# EAGLE design HandiFinder (EAGLE 9.4.1)
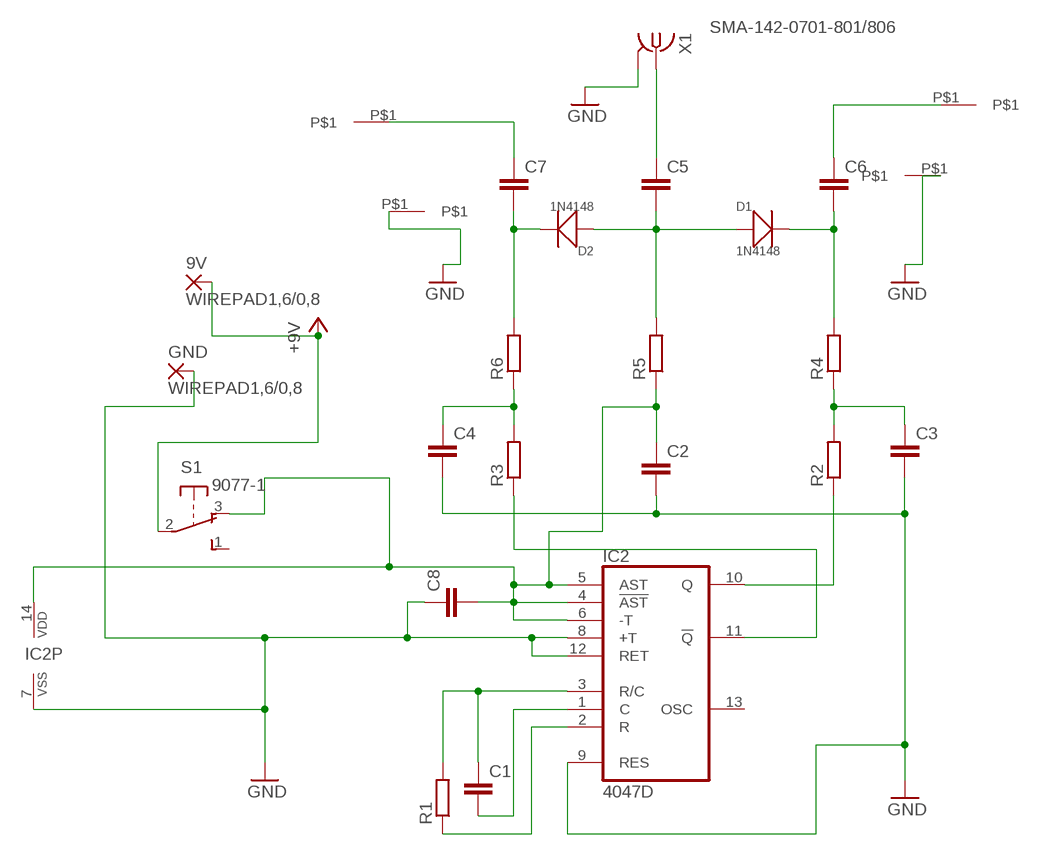
[diagram p0: schematic, sheet 1]

## Parts
9V  WIREPAD1,6/0,8  [1,6/0,8]
ANT1  ANT12  WIREPAD  [2.6MMHOLE]
ANT1GND2  WIREPAD  [2.6MMHOLE]
ANT2GND2  WIREPAD  [2.6MMHOLE]
ANT22  WIREPAD  [2.6MMHOLE]
C1  C-EUC0805K  [C0805K]
C2  C-EUC0805K  [C0805K]
C3  C-EUC0805K  [C0805K]
C4  C-EUC0805K  [C0805K]
C5  C-EUC0805K  [C0805K]
C6  C-EUC0805K  [C0805K]
C7  C-EUC0805K  [C0805K]
C8  C-EUC0805K  [C0805K]
D1  1N4148  SMD-DIODE-100V-200MA(SOD-123)  [SOD-123]
D2  1N4148  SMD-DIODE-100V-200MA(SOD-123)  [SOD-123]
GND  WIREPAD1,6/0,8  [1,6/0,8]
IC2  4047D  [SO14]
R1  R-EU_R0805  [R0805]
R2  R-EU_R0805  [R0805]
R3  R-EU_R0805  [R0805]
R4  R-EU_R0805  [R0805]
R5  R-EU_R0805  [R0805]
R6  R-EU_R0805  [R0805]
S1  9077-1  [9077-1]
X1  SMA-142-0701-801/806  [J502-ND-142-0701-801/806]

## Nets
+5V: 9V.1(P) S1.2(P) ; supply symbol labelled +9V
GND: ANT1GND2.P$1 ANT2GND2.P$1 C2.2 C3.2 C4.2 C8.1 GND.1(P) IC2.7(VSS) IC2.8(+T) IC2.9(RES) IC2.12(RET) X1.G@1 X1.G@2 X1.G@3 X1.G@4
N$1: C1.1 IC2.3(R/C) R1.2
N$2: C1.2 IC2.1(C)
N$3: IC2.2(R) R1.1
N$4: C7.2 D2.- R6.2
N$5: C3.1 R2.2 R4.1
N$6: C5.1 X1.1
N$7: C4.1 R3.2 R6.1
N$8: IC2.11(!Q) R3.1
N$9: IC2.10(Q) R2.1
N$10: C5.2 D1.+ D2.+ R5.2
N$11: C6.2 D1.- R4.2
N$14: ANT1.P$1 C7.1
N$15: ANT22.P$1 C6.1
N$16: C2.1 C8.2 IC2.4(!AST) IC2.5(AST) IC2.6(-T) IC2.14(VDD) R5.1 S1.3(O)
Unconnected: IC2.13(OSC) S1.1(S)

## Library data of the parts
9V GND = wirepad:WIREPAD: Wire PAD connect wire on PCB
ANT1 ANT1GND2 ANT2GND2 ANT22 = wirepad2.6:WIREPAD
C1-C8 = resistor:C-EU: CAPACITOR, European symbol
D1 D2 = Seeed-Diode-2016:SMD-DIODE-100V-200MA(SOD-123): 304010007; MPN: MMSD4148; VALUE: MMSD4148-sod123
IC2 = 40xx:4047: LP monostable/astable MULTIVIBRATOR
R1-R6 = resistor:R-EU_: RESISTOR, European symbol
S1 = switch-misc:9077-1: MARQUARDT SWITCH 9077.0100 Distributor: Buerklin <https://www.buerklin.com/default.asp?event=ShowArtikel%2812G2820%29&l=d&jump=ArtNr_12G2820>
X1 = con-coax:SMA-: SMA 50 Ohm End Launch Jack Receptacle - Round Contact Johnson Components Source: www.johnsoncomponents.com .. J502-ND.pdf; MF: JOHNSON COMPONENTS; MPN: 142-0701-801; OC_FARNELL: 1608592; OC_NEWARK: 90F2624

## Board
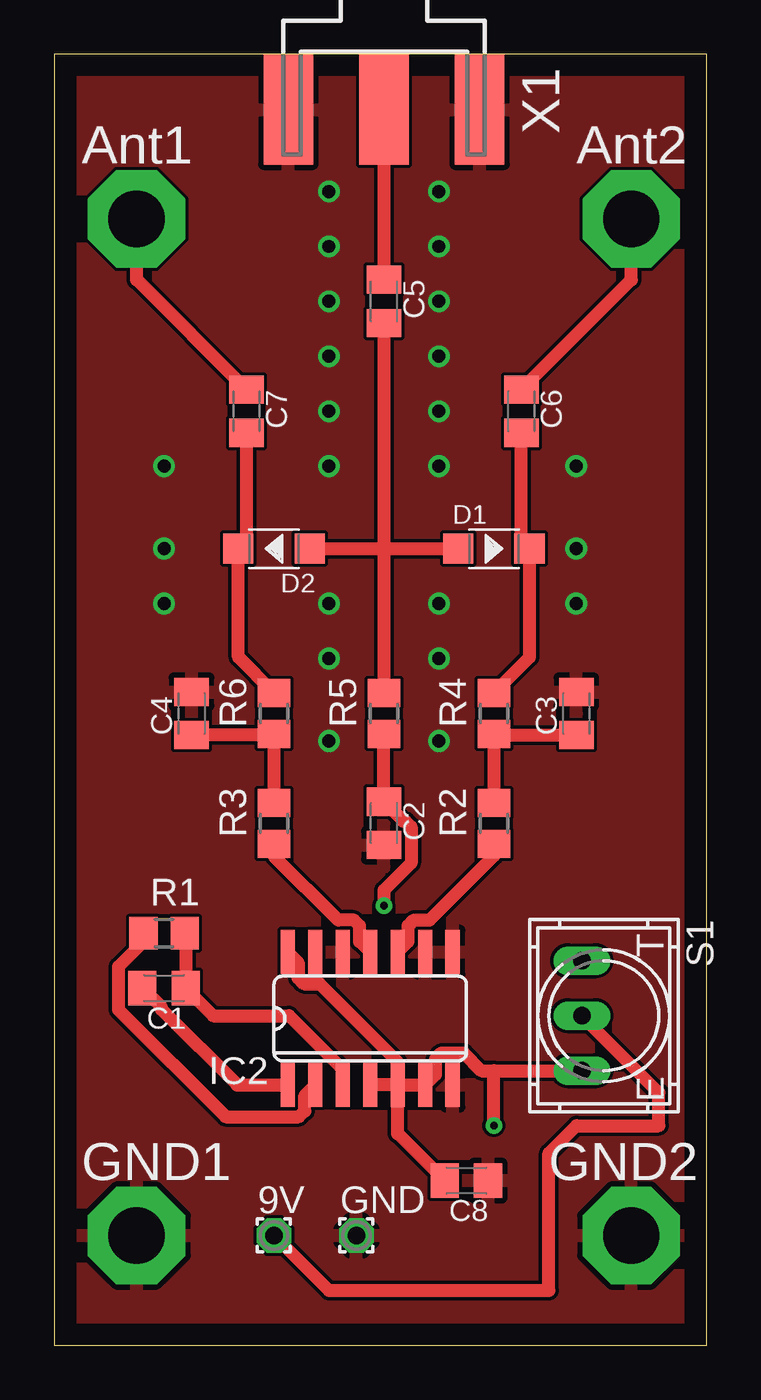
[diagram p1: board, top side]
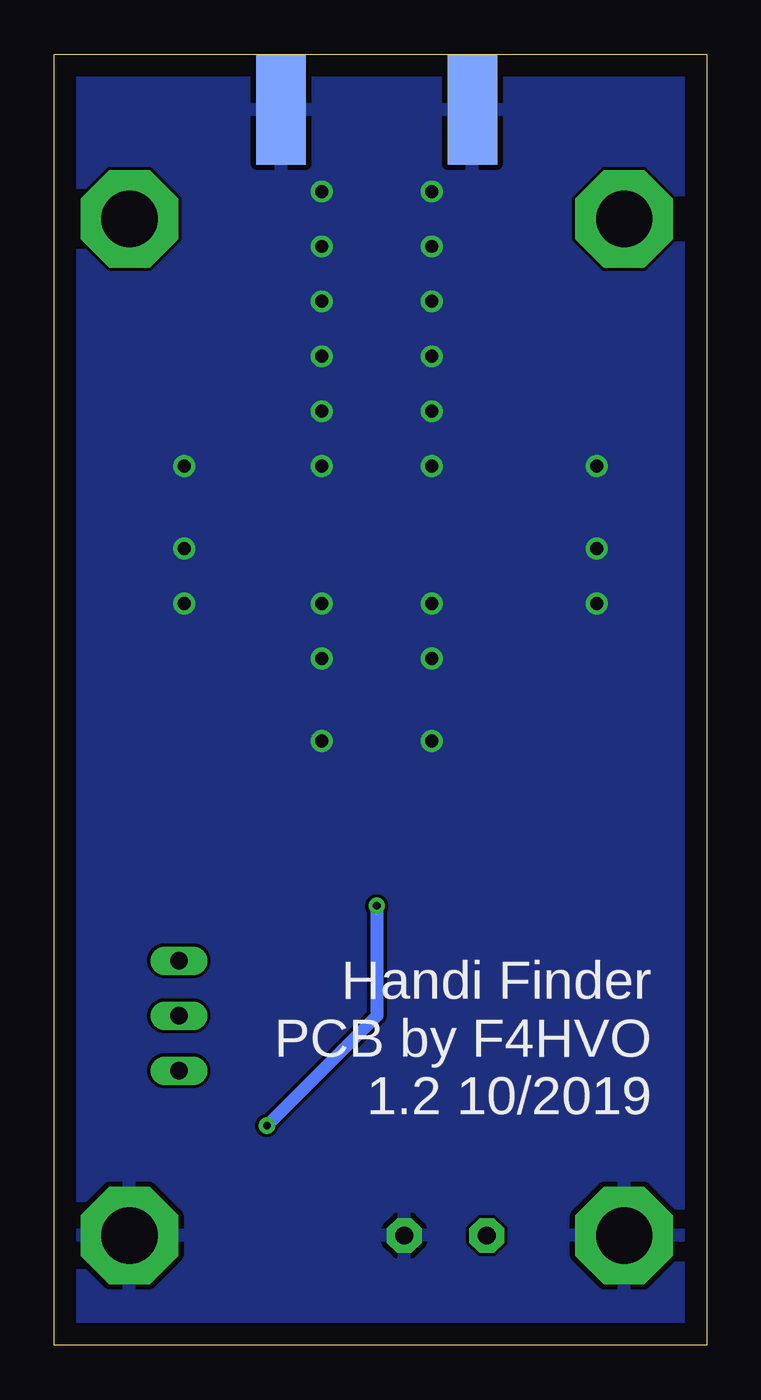
[diagram p2: board, bottom side, seen from below]

Size 30.15 x 59.69 mm. Coordinates in mm from the lower left corner, seen from the top.
Outline: 0,0 30.15,0 30.15,59.68 0,59.68 0,0
Copper layers (1*16): Top 0.035mm / dielectric 1.5mm / Bottom 0.035mm
Design rules "default": minimum track width 6mil, minimum drill 0.35mm, track to track 6mil, track to pad 6mil, pad to pad 6mil, via to via 6mil, smd to smd 6mil, copper to edge 40mil, drill to drill 6mil, minimum pad ring 10mil, minimum via ring 8mil, stop-mask expansion 4mil, vias tented up to drill 0mil, thermal gap 10mil

### Footprints (pad centres in the part's own frame; a part is rotated, then mirrored left to right if it is on the bottom)
1,6/0,8 = drill 0.813 pad 1.6 octagon: 1 0,0
2.6MMHOLE = drill 2.6 pad 4.5 octagon: P$1 0,0
C0805K = smd 1.3 x 1.6: 1 -1,0; 2 1,0
SOD-123 = smd 1.397 x 1.397: + -1.651,0; - 1.651,0
SO14 = smd 0.66 x 2.032: 1 -3.81,-3.073; 2 -2.54,-3.073; 3 -1.27,-3.073; 4 0,-3.073; 5 1.27,-3.073; 6 2.54,-3.073; 7 3.81,-3.073; 8 3.81,3.073; 9 2.54,3.073; 10 1.27,3.073; 11 0,3.073; 12 -1.27,3.073; 13 -2.54,3.073; 14 -3.81,3.073
R0805 = smd 1.3 x 1.5: 1 -0.95,0; 2 0.95,0
9077-1 = drill 0.813 long: 1 -2.54,-1.016; 2 0,-1.016; 3 2.54,-1.016
J502-ND-142-0701-801/806 = smd 5.08 x 2.286: 1 2.565,0; G@1 2.565,4.42; G@2 2.565,-4.42 | smd 5.08 x 2.286 bottom: G@3 2.565,4.42; G@4 2.565,-4.42

### Placement (x,y rotation side)
9V  10.16,5.08 0 top
ANT1  3.81,52.07 0 top
ANT1GND2  3.81,5.08 0 top
ANT2GND2  26.67,5.08 0 top
ANT22  26.67,52.07 0 top
C1  5.08,16.51 180 top
C2  15.24,24.13 270 top
C3  24.13,29.21 90 top
C4  6.35,29.21 90 top
C5  15.24,48.26 270 top
C6  21.59,43.18 270 top
C7  8.89,43.18 270 top
C8  19.05,7.62 180 top
D1  20.32,36.83 0 top
D2  10.16,36.83 180 top
GND  13.97,5.08 0 top
IC2  14.61,15.11 0 top
R1  5.08,19.05 0 top
R2  20.32,24.13 90 top
R3  10.16,24.13 90 top
R4  20.32,29.21 90 top
R5  15.24,29.21 90 top
R6  10.16,29.21 90 top
S1  25.4,15.24 270 top
X1  15.24,59.69 270 top

### Tracks (layer width: path | path; a pad name or v marks a point on that pad's centre or on a via)
+5V
  Top 0.61: 9V.1 12.7,2.54 22.86,2.54 22.86,8.89 24.13,10.16 27.94,10.16 27.94,11.68 S1.2
GND  (via drill 0.6)
  other vias: 12.7,53.34 17.78,53.34 17.78,50.8 12.7,50.8 12.7,48.26 17.78,48.26 12.7,45.72 17.78,45.72 17.78,43.18 12.7,43.18 12.7,40.64 17.78,40.64 24.13,40.64 24.13,36.83 24.13,34.29 17.78,34.29 12.7,34.29 12.7,31.75 17.78,31.75 17.78,27.94 12.7,27.94 5.08,40.64 5.08,36.83 5.08,34.29
  pour Top: -1.27,62.23 31.75,62.23 31.75,0 30.48,-1.27 -1.27,-1.27
  pour Bottom: -1.27,60.96 30.48,60.96 30.48,-1.27 -2.54,-1.27 -2.54,59.69
N$1
  Top 0.61: R1.2 6.08,19 C1.1 7.35,15.24 10.86,15.24 13.34,12.76 IC2.3
N$2
  Top 0.61: C1.2 4.97,15.62 4.97,15.52 8.45,12.04 IC2.1
N$3
  Top 0.61: IC2.2 11.58,11.56 11.58,10.83 11.31,10.57 7.93,10.57 2.97,15.52 2.97,17.5 4.13,18.66 R1.1
N$4
  Top 0.61: C7.2 8.89,37.21 D2.- 8.51,31.81 R6.2
N$5
  Top 0.61: R2.2 R4.1 20.37,28.21 C3.1
N$6
  Top 0.61: X1.1 C5.1
N$7
  Top 0.61: R3.2 R6.1 10.11,28.21 C4.1
N$8
  Top 0.61: R3.1 10.16,22.63 13.13,19.66 13.86,19.66 14.12,19.39 14.12,18.67 IC2.11
N$9
  Top 0.61: R2.1 20.32,22.63 17.35,19.66 16.62,19.66 16.36,19.39 16.36,18.67 IC2.10
N$10
  Top 0.61: C5.2 15.24,36.83 | 15.24,36.83 R5.2 | D2.+ 15.24,36.83 | 15.24,36.83 D1.+
N$11
  Top 0.61: R4.2 21.97,31.81 D1.- 21.59,37.21 C6.2
N$14
  Top 0.61: C7.1 3.81,49.26 ANT1.P$1
N$15
  Top 0.61: C6.1 26.67,49.26 ANT22.P$1
N$16  (via drill 0.35)
  Top 0.61: R5.1 C2.1 16.13,24.24 16.23,24.24 16.5,23.97 16.5,22.29 15.24,21.03 v15.24,20.32 | C8.2 15.88,9.79 IC2.5 | IC2.5 IC2.4 | IC2.5 IC2.6 17.63,12.52 17.63,13.24 17.89,13.51 18.93,13.51 19.75,12.7 20.32,12.7 | 20.32,12.7 S1.3 | v20.32,10.16 20.32,12.7 | IC2.5 15.88,13.11 12.27,16.71 11.54,16.71 11.28,16.98 11.28,17.7 IC2.14
  Bottom 0.61: v15.24,20.32 15.24,15.24 v20.32,10.16

### Text on the board
bPlace: Handi Finder / PCB by F4HVO / 1.2 10/2019
tNames: Ant1 | Ant2 | GND1 | GND2